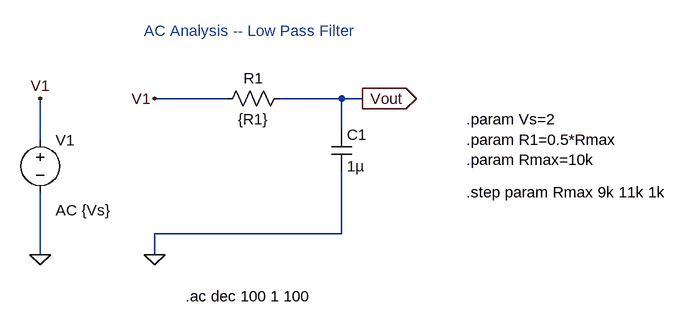
[diagram p0: schematic ac.asc]
ac.asc, the LTspice schematic file:
Version 4
SHEET 1 880 680
WIRE 128 128 16 128
WIRE 304 128 208 128
WIRE 336 128 304 128
WIRE 304 176 304 128
WIRE -160 192 -160 128
WIRE 304 336 304 240
WIRE 304 336 16 336
WIRE -160 368 -160 272
WIRE 16 368 16 336
FLAG -160 368 0
FLAG 336 128 Vout
IOPIN 336 128 Out
FLAG -160 128 V1
FLAG 16 128 V1
FLAG 16 368 0
SYMBOL voltage -160 176 R0
WINDOW 123 24 124 Left 2
WINDOW 39 0 0 Left 0
SYMATTR Value2 AC {Vs}
SYMATTR InstName V1
SYMATTR Value ""
SYMBOL res 224 112 R90
WINDOW 0 0 56 VBottom 2
WINDOW 3 32 56 VTop 2
SYMATTR InstName R1
SYMATTR Value {R1}
SYMBOL cap 288 176 R0
SYMATTR InstName C1
SYMATTR Value 1µ
TEXT 0 24 Left 2 ;AC Analysis -- Low Pass Filter
TEXT 64 432 Left 2 !.ac dec 100 1 100
TEXT 496 160 Left 2 !.param Vs=2\n.param R1=0.5*Rmax \n.param Rmax=10k
TEXT 496 272 Left 2 !.step param Rmax 9k 11k 1k

The netlist it stands for:
* ac.asc
V1 V1 0 AC {Vs}
R1 Vout V1 {R1}
C1 Vout 0 1µ
* AC Analysis -- Low Pass Filter
.ac dec 100 1 100
.param Vs=2
.param R1=0.5*Rmax
.param Rmax=10k
.step param Rmax 9k 11k 1k
.backanno
.end

* Results of the author's LTspice run, read from the files saved beside the schematic
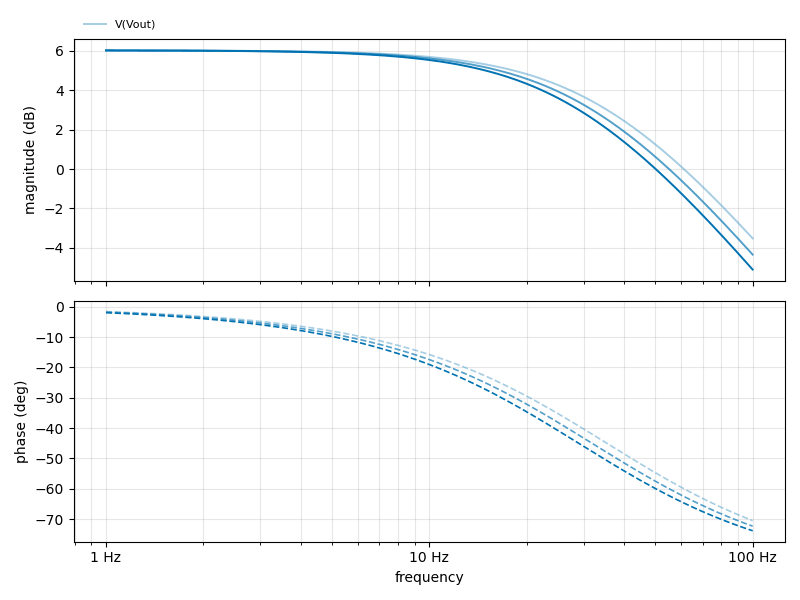
[diagram p1: AC Analysis of ac.asc, plotted from the saved traces]
* AC Analysis, 3 runs:
*   V(Vout) [run 1]: 6.02 dB at 1 Hz, -3.52 dB at 100 Hz, peak 6.02 dB at 1 Hz, 3 dB below the peak at 35.4 Hz
*   V(Vout) [run 2]: 6.02 dB at 1 Hz, -4.34 dB at 100 Hz, peak 6.02 dB at 1 Hz, 3 dB below the peak at 31.86 Hz
*   V(Vout) [run 3]: 6.02 dB at 1 Hz, -5.10 dB at 100 Hz, peak 6.02 dB at 1 Hz, 3 dB below the peak at 28.97 Hz